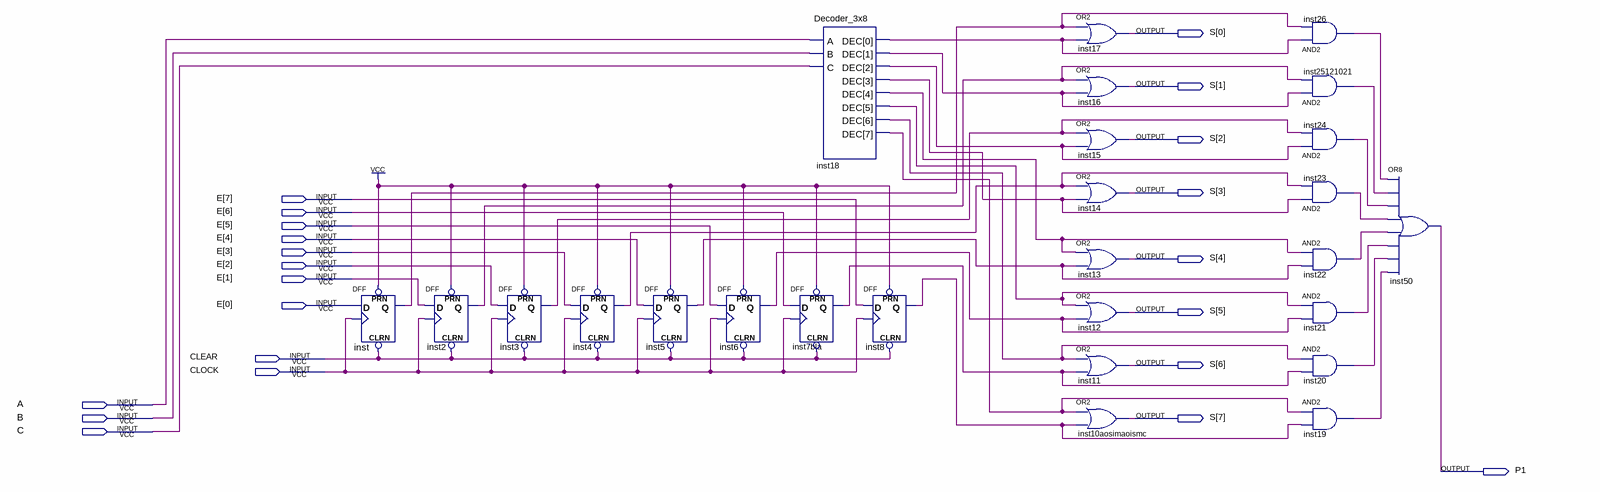
[diagram p0: schematic sheet]
// Quartus schematic row_1.bdf as structural Verilog: 26 symbols, 22 pins
module row_1 (
  input  [7:0] E,
  input  CLEAR,
  input  CLOCK,
  input  A,
  input  B,
  input  C,
  output [7:0] S,
  output P1
);

  wire inst2_q, inst3_q, inst4_q, inst5_q, inst6_q, inst7bla_q, inst8_q, inst18_dec, inst18_dec_2,
       inst18_dec_3, inst18_dec_4, inst18_dec_5, inst18_dec_6, inst18_dec_7, inst18_dec_8, inst19_out,
       inst20_out, inst21_out, inst22_out, inst23_out, inst24_out, inst26_out, inst25121021_out, inst_q;

  DFF inst (.CLRN(CLEAR), .CLK(CLOCK), .D(E[0]), .PRN(1'b1), .Q(inst_q));
  DFF inst2 (.CLRN(CLEAR), .CLK(CLOCK), .D(E[1]), .PRN(1'b1), .Q(inst2_q));
  DFF inst3 (.CLRN(CLEAR), .CLK(CLOCK), .D(E[2]), .PRN(1'b1), .Q(inst3_q));
  DFF inst4 (.CLRN(CLEAR), .CLK(CLOCK), .D(E[3]), .PRN(1'b1), .Q(inst4_q));
  DFF inst5 (.CLRN(CLEAR), .CLK(CLOCK), .D(E[4]), .PRN(1'b1), .Q(inst5_q));
  DFF inst6 (.CLRN(CLEAR), .CLK(CLOCK), .D(E[5]), .PRN(1'b1), .Q(inst6_q));
  DFF inst7bla (.CLRN(CLEAR), .CLK(CLOCK), .D(E[6]), .PRN(1'b1), .Q(inst7bla_q));
  Decoder_3x8 inst18 (
    .A(A), .B(B), .C(C),
    .DEC({inst18_dec, inst18_dec_2, inst18_dec_3, inst18_dec_4, inst18_dec_5, inst18_dec_6, inst18_dec_7, inst18_dec_8}));
  DFF inst8 (.CLRN(CLEAR), .CLK(CLOCK), .D(E[7]), .PRN(1'b1), .Q(inst8_q));
  or inst17 (S[0], inst_q, inst18_dec_8);
  or inst16 (S[1], inst2_q, inst18_dec_7);
  or inst15 (S[2], inst3_q, inst18_dec_6);
  or inst14 (S[3], inst4_q, inst18_dec_5);
  or inst13 (S[4], inst18_dec_4, inst5_q);
  or inst12 (S[5], inst18_dec_3, inst6_q);
  or inst11 (S[6], inst18_dec_2, inst7bla_q);
  or inst10aosimaoismc (S[7], inst18_dec, inst8_q);
  and inst26 (inst26_out, inst18_dec_8, inst_q);
  and inst25121021 (inst25121021_out, inst18_dec_7, inst2_q);
  and inst24 (inst24_out, inst18_dec_6, inst3_q);
  and inst23 (inst23_out, inst18_dec_5, inst4_q);
  and inst22 (inst22_out, inst18_dec_4, inst5_q);
  and inst21 (inst21_out, inst18_dec_3, inst6_q);
  and inst20 (inst20_out, inst18_dec_2, inst7bla_q);
  and inst19 (inst19_out, inst18_dec, inst8_q);
  or inst50 (P1, inst26_out, inst25121021_out, inst24_out, inst23_out, inst22_out, inst21_out, inst20_out, inst19_out);
endmodule
